# Altium schematic sheet Digital_Input2.SchDoc
size A4; SheetNumber: 3; SheetTotal: 16
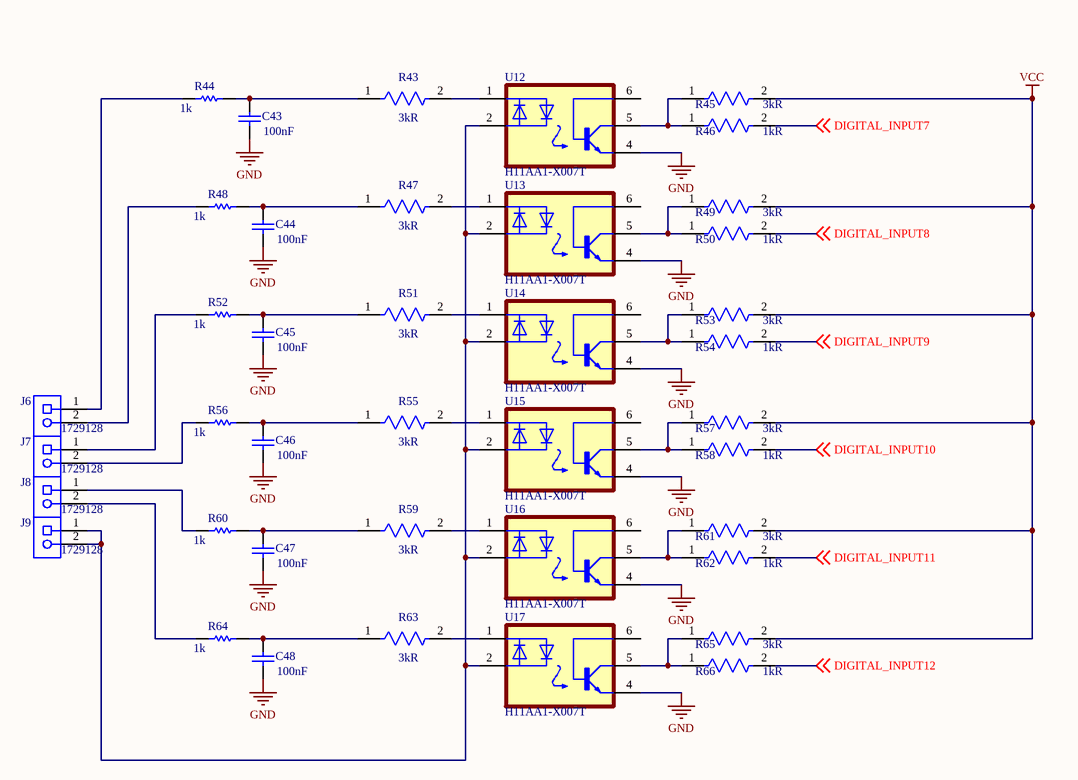
[diagram p0: Digital_Input2.SchDoc]

## Parts
C43  value 100nF  [CAPC1608X87X35NL15T15]  (hidden comment: C0603T104K3RACTU)
C44  value 100nF  [CAPC1608X87X35NL15T15]  (hidden comment: C0603T104K3RACTU)
C45  value 100nF  [CAPC1608X87X35NL15T15]  (hidden comment: C0603T104K3RACTU)
C46  value 100nF  [CAPC1608X87X35NL15T15]  (hidden comment: C0603T104K3RACTU)
C47  value 100nF  [CAPC1608X87X35NL15T15]  (hidden comment: C0603T104K3RACTU)
C48  value 100nF  [CAPC1608X87X35NL15T15]  (hidden comment: C0603T104K3RACTU)
J6  1729128  [PHOE-1729128-2_V]
J7  1729128  [PHOE-1729128-2_V]
J8  1729128  [PHOE-1729128-2_V]
J9  1729128  [PHOE-1729128-2_V]
R43  Resistance: 3kR  [FP-CRCW0603-e3-IPC_A]  (hidden comment: CRCW06033K00FKEA)
R44  value 1k  [RESC1608X55X25LL10T15]  (hidden comment: RT0603DRE071KL)
R45  Resistance: 3kR  [FP-CRCW0603-e3-IPC_A]  (hidden comment: CRCW06033K00FKEA)
R46  Resistance: 1kR  [FP-RC0603-0_55-IPC_C]  (hidden comment: RC0603FR-071KL)
R47  Resistance: 3kR  [FP-CRCW0603-e3-IPC_A]  (hidden comment: CRCW06033K00FKEA)
R48  value 1k  [RESC1608X55X25LL10T15]  (hidden comment: RT0603DRE071KL)
R49  Resistance: 3kR  [FP-CRCW0603-e3-IPC_A]  (hidden comment: CRCW06033K00FKEA)
R50  Resistance: 1kR  [FP-RC0603-0_55-IPC_C]  (hidden comment: RC0603FR-071KL)
R51  Resistance: 3kR  [FP-CRCW0603-e3-IPC_A]  (hidden comment: CRCW06033K00FKEA)
R52  value 1k  [RESC1608X55X25LL10T15]  (hidden comment: RT0603DRE071KL)
R53  Resistance: 3kR  [FP-CRCW0603-e3-IPC_A]  (hidden comment: CRCW06033K00FKEA)
R54  Resistance: 1kR  [FP-RC0603-0_55-IPC_C]  (hidden comment: RC0603FR-071KL)
R55  Resistance: 3kR  [FP-CRCW0603-e3-IPC_A]  (hidden comment: CRCW06033K00FKEA)
R56  value 1k  [RESC1608X55X25LL10T15]  (hidden comment: RT0603DRE071KL)
R57  Resistance: 3kR  [FP-CRCW0603-e3-IPC_A]  (hidden comment: CRCW06033K00FKEA)
R58  Resistance: 1kR  [FP-RC0603-0_55-IPC_C]  (hidden comment: RC0603FR-071KL)
R59  Resistance: 3kR  [FP-CRCW0603-e3-IPC_A]  (hidden comment: CRCW06033K00FKEA)
R60  value 1k  [RESC1608X55X25LL10T15]  (hidden comment: RT0603DRE071KL)
R61  Resistance: 3kR  [FP-CRCW0603-e3-IPC_A]  (hidden comment: CRCW06033K00FKEA)
R62  Resistance: 1kR  [FP-RC0603-0_55-IPC_C]  (hidden comment: RC0603FR-071KL)
R63  Resistance: 3kR  [FP-CRCW0603-e3-IPC_A]  (hidden comment: CRCW06033K00FKEA)
R64  value 1k  [RESC1608X55X25LL10T15]  (hidden comment: RT0603DRE071KL)
R65  Resistance: 3kR  [FP-CRCW0603-e3-IPC_A]  (hidden comment: CRCW06033K00FKEA)
R66  Resistance: 1kR  [FP-RC0603-0_55-IPC_C]  (hidden comment: RC0603FR-071KL)
U12  H11AA1-X007T  [SOIC254P1030X460-6N]
U13  H11AA1-X007T  [SOIC254P1030X460-6N]
U14  H11AA1-X007T  [SOIC254P1030X460-6N]
U15  H11AA1-X007T  [SOIC254P1030X460-6N]
U16  H11AA1-X007T  [SOIC254P1030X460-6N]
U17  H11AA1-X007T  [SOIC254P1030X460-6N]

## Nets
GND: C43.1 C44.1 C45.1 C46.1 C47.1 C48.1 U12.4(E) U13.4(E) U14.4(E) U15.4(E) U16.4(E) U17.4(E)
VCC: R45.2 R49.2 R53.2 R57.2 R61.2 R65.2
DIGITAL_INPUT7: R46.2 ; off-sheet DIGITAL_INPUT7
DIGITAL_INPUT8: R50.2 ; off-sheet DIGITAL_INPUT8
DIGITAL_INPUT9: R54.2 ; off-sheet DIGITAL_INPUT9
DIGITAL_INPUT10: R58.2 ; off-sheet DIGITAL_INPUT10
DIGITAL_INPUT11: R62.2 ; off-sheet DIGITAL_INPUT11
DIGITAL_INPUT12: R66.2 ; off-sheet DIGITAL_INPUT12
NetC43_2: C43.2 R43.1 R44.2
NetC44_2: C44.2 R47.1 R48.2
NetC45_2: C45.2 R51.1 R52.2
NetC46_2: C46.2 R55.1 R56.2
NetC47_2: C47.2 R59.1 R60.2
NetC48_2: C48.2 R63.1 R64.2
NetJ6_1: J6.1 R44.1
NetJ6_2: J6.2 R48.1
NetJ7_1: J7.1 R52.1
NetJ7_2: J7.2 R56.1
NetJ8_1: J8.1 R60.1
NetJ8_2: J8.2 R64.1
NetJ9_1: J9.1 J9.2 U12.2(C/A) U13.2(C/A) U14.2(C/A) U15.2(C/A) U16.2(C/A) U17.2(C/A)
NetR43_2: R43.2 U12.1(A/C)
NetR45_1: R45.1 R46.1 U12.5(C)
NetR47_2: R47.2 U13.1(A/C)
NetR49_1: R49.1 R50.1 U13.5(C)
NetR51_2: R51.2 U14.1(A/C)
NetR53_1: R53.1 R54.1 U14.5(C)
NetR55_2: R55.2 U15.1(A/C)
NetR57_1: R57.1 R58.1 U15.5(C)
NetR59_2: R59.2 U16.1(A/C)
NetR61_1: R61.1 R62.1 U16.5(C)
NetR63_2: R63.2 U17.1(A/C)
NetR65_1: R65.1 R66.1 U17.5(C)

Not connected (* = marked no-connect by the designer): U12 6(B); U13 6(B); U14 6(B); U15 6(B); U16 6(B); U17 6(B)

## Library data of the parts
C43-C48 = CMP-2006-03843-1: Manufacturer: Kemet; Part Number: C0603T104K3RACTU
J6-J9 = CMP-2000-05815-1: PCB Terminal Block, 13.5 A, 400 V, 2-Pin THD, RoHS, Bulk; Manufacturer: Phoenix Contact; Package Version: 03/2015; No. of Rows: 1; Pitch: 5.08mm; No. of Positions: 2; Voltage Rating: 400V; Current Rating: 13500mA; Manufacturer URL: http://www.phoenixcontact.com/; Datasheet URL: https://datasheet.ciiva.com/16046/1729128-16046181.pdf; RoHS: TRUE; Package URL: https://www.phoenixcontact.com/online/portal/pi/pxc/product_detail_page/!ut/p/b1/3VdJjqNKFDxLH8AFycySyWY2ozFsEPOMMQaDOX1XedGL_1Vdm5YXJleknhSKeBkvI6EA8ncAo3AYoDhBQGco6KN7VURTdemj9us_IEKEZo_YHiPAEWEFmDGOHMORkqKYCORBZxgL7ZoaZYcbFFUZ3fqxSY6GOuxydWUuHqz1ynmMFygu583Bob0Ewr6Sd_l-5m-kAueHiB0jpRwZwe58wwtkpxtMYd_LmGcDRU02dRNEyWt6Y2ti5pSyJ_reIkzIulrqApdnbT11V5jnCKbYNCvhEM1MCpPByat_X379-iThf08CI5GfOPqfBeS3BRoBOdD55AKVv0iLwCMq-2BrzXWSGRH7pUGD9uwXQjiph3xL0DKQwdGa0JImiIOmBNOestqgwTHSSs2oOep-78apyXQBvNi8ZLaFjvjWvcaUEBu0MC6Wbe-d6mB0FAebo2lUWinqYaZs5DAYzV0RP9yitUjnGJ0iI9xhZkT42OCQNUJJhkgWINNQLP2JFP6OpMg3JCVg70jqHT0lvKOnhHf0lPuOnnLf0VPuWx6_dxwUIvwk5WMkT0kLL1mh61l2yZVSzG3pYV_bqo-mj6uMKwKwdnnW8Jh5RTOJzMOA5c-eJDaZQw4mTMPH02PvS_ZAqNVjVTo2WyYLkwH_KU1mmmG5kjRhDqPXLwwVHvVOjCM60-fpXvTDfMGW1PVFVS1r4e4yVDk4ZdNbkUHvqPqQSeian4UD39fNKmachqdJ1NJbyk8rXT9mXTvPk3oE5meulKGgiruPJek-4I9hTT6G8ZLOyRSm2RRVbThERQad5OS28hdt4YW4vG0stgYYzsWsK4_7y6DZMjJSCqri1kyiZR5vD7pwIrNR7QwPHTcLTI5qT7eRlpHrdGiupYlqQDJ7zy_CND8fWWBoLRXxk1RVcXiBQwbTD4Xi7KL-FuO94t9xaqweXzH; PartNumber: 1729128; Package Description: 2-Pin Through Hole Device, Body 8.1 x 10.16 mm, Pitch 5.08 mm; Datasheet Version: 12/2013; Mounting Technology: ThroughHole; Orientation: Horizontal; Package Reference: 1729128-2; Packing: Bulk
R43 R45 R47 R49 R51 R53 R55 R57 R59 R61 R63 R65 = CMP-2000-03293-2: RES Thick Film, 3kΩ, 1%, 0.1W, 100ppm/°C, 0603; Voltage Rating: 75V; Power Rating: 100mW; Features: Automotive AEC-Q200; Radiation Hardening: No; Contact Plating: Tin; Termination: SMD/SMT; Lead Free: Lead Free; Case Code (Imperial): 0603; Case Code (Metric): 1608; Case/Package: 0603; Depth: 0.85mm; Mount: Surface Mount; Voltage Rating (DC): 75V; Tolerance: 1%; Package Quantity: 10; Temperature Coefficient: 100ppm/°C; Height: 0.45mm; Max Power Dissipation: 100mW; Composition: Thick Film; Max Operating Temperature: 155°C; Military Standard: Not; Weight: 7.1E-05oz; Length: 1.55mm; Packaging: Tape and Reel; Number of Terminations: 2; Width: 0.85mm; Min Operating Temperature: -55°C
R44 R48 R52 R56 R60 R64 = CMP-2000-04615-1: Manufacturer: Yageo; Part Number: RT0603DRE071KL
R46 R50 R54 R58 R62 R66 = CMP-1659-00009-5: RES 1K OHM 1% 1/10W 0603; Voltage Rating: 50V; Power Rating: 100mW; Temperature Coefficient: 100ppm/°C; Military Standard: Not; REACH SVHC: No SVHC; Size Code: 0603; Features: Moisture Resistant; Number of Terminations: 2; Technology: THICK FILM; Series: RC; Case Code (Metric): 1608; Resistance Tolerance: 1%; Resistor Type: Thick Film; Termination: SMD/SMT; Contact Plating: Tin; Radiation Hardening: No; Min Operating Temperature: -55°C; Max Operating Temperature: 155°C; Packaging: Tape and Reel; Max Power Dissipation: 100mW; RoHS Compliant: Yes; Height: 0.45mm; Lead Free: Lead Free; Case/Package: 0603; Length: 1.6mm; Tolerance: 1%; Case Code (Imperial): 0603; Construction: Rectangular; Depth: 0.8mm
U12-U17 = H11AA1-X007T: H11AA1 Series Single Channel 30V 5300 Vrms SMT Phototransistor Optocoupler DIP-6; MF: Vishay Semiconductor; SnapEDA_Link: https://www.snapeda.com/parts/H11AA1-X007T/Vishay/view-part/?ref=snap; Package: SMD-6 Vishay; Value: *; MP: H11AA1-X007T; Check_prices: https://www.snapeda.com/parts/H11AA1-X007T/Vishay/view-part/?ref=eda